# Altium schematic sheet Energy Inputs.SchDoc: Energy Inputs
size 292 x 193 mm; SheetNumber: 9; SheetTotal: 12
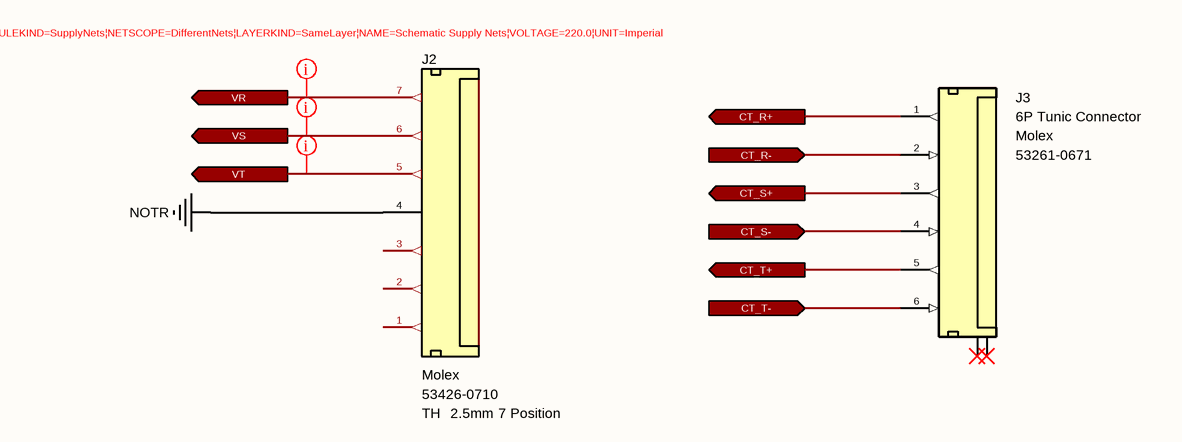
[diagram p0: Energy Inputs.SchDoc]

## Parts
J2  Manufacturer Name: Molex  Case: TH  Pitch: 2.5mm  Position: 7 Position  [Connector 7P (2.54)]  (hidden comment: 53426-0710)
J3  6P Tunic Connector  Manufacturer Part Number: 53261-0671  Manufacturer Name: Molex  [Connector_Tunic 6P]

## Ports
CT_R+ (out), CT_R- (in), CT_S+ (out), CT_S- (in), CT_T+ (out), CT_T- (in), VR (out), VS (out), VT (out)

## Nets
NOTR: J2.4(Pin-4)
CT_R+: J3.1(CT_R+) ; port CT_R+
CT_R-: J3.2(CT_R-) ; port CT_R-
CT_S+: J3.3(CT_S+) ; port CT_S+
CT_S-: J3.4(CT_S-) ; port CT_S-
CT_T+: J3.5(CT_T+) ; port CT_T+
CT_T-: J3.6(CT_T-) ; port CT_T-
VR: J2.7(Pin-7) ; port VR
VS: J2.6(Pin-6) ; port VS
VT: J2.5(Pin-5) ; port VT

Not connected (* = marked no-connect by the designer): J2 1(Pin-1) 2(Pin-2) 3(Pin-3); J3 7(Case)* 8(Case)*

## Layout directives
rule Supply Nets [Voltage = 220.0]; net class HV: VR, VS, VT

## Notes on the sheet
- © 2021 All rights reserved.
  This document may not, in whole or in part, be copied, photocopied, reproduced, translated or converted to any electronic or machine readable from without prior written permission of Mehmet Günce Akkoyun.
  Engineer contact : akkoyun@me.com
- Property of
- Engineer :
- Date :
- Size :
- A4
- Time :
- Project :
- Page :
- /
- Customer :
- Product ID :
- Module ID :
- Version :
- File :
- Revision :

## Library data of the parts
J2 = Connector - Tunic 7P (2.5): 2.50mm Pitch Mini-Lock Wire-to-Board Header Right Angle Friction and Positive Lock 7 Circuits; System: Connector; Manufacturer Part Number: 53426-0710
J3 = Connector - Mini Tunic 6P (1.25): Mini Tunic Connector with 6P; ROHS: Yes